# EAGLE design OMNIBUS EstlCam board v3 (EAGLE 9.3.1)
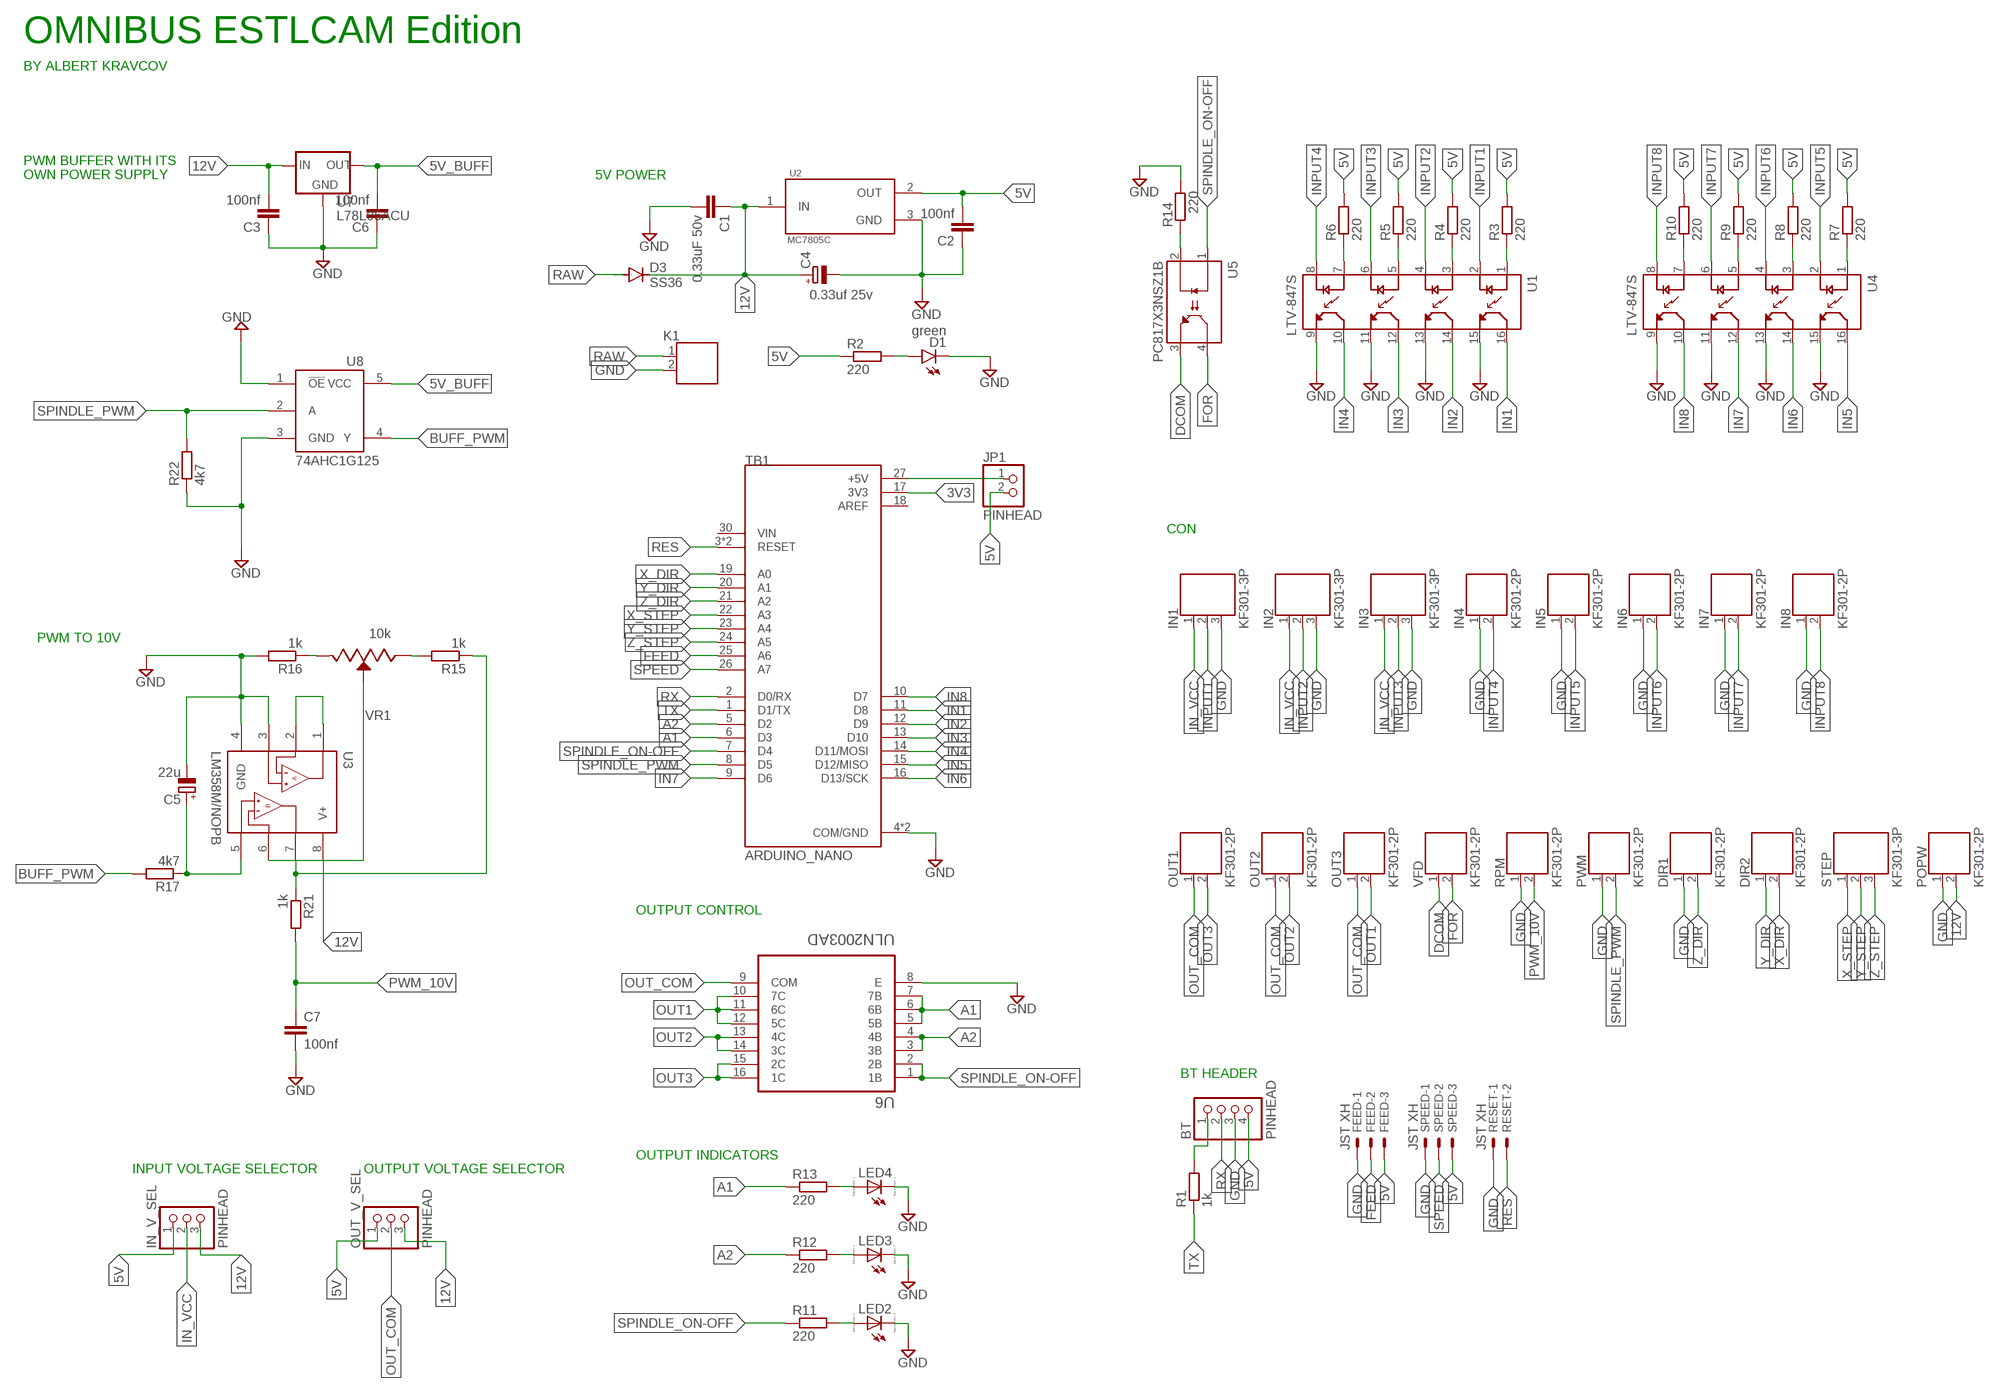
[diagram p0: schematic, sheet 1]

## Parts
BT  PINHEAD  PINHD-1X4  [1X04]
C1  0.33uF 50v  C-EUC1206  [C1206]
C2  100nf  C-EUC0805  [C0805]
C3  100nf  C-EUC0805  [C0805]
C4  0.33uf 25v  CPOL-EUE2-5  [E2-5]
C5  22u  CPOL-EUE2-5  [E2-5]
C6  100nf  C-EUC0805  [C0805]
C7  100nf  C-EUC0805  [C0805]
D1  green  LEDCHIPLED_0805  [CHIPLED_0805]
D3  SS36  ES2D  [SMB]
DIR1  KF301-2P  691131710002  [691131710002]
DIR2  KF301-2P  691131710002  [691131710002]
FEED  JST XH  22-23-2031  [22-23-2031]
IN1  KF301-3P  691131710003  [691131710003]
IN2  KF301-3P  691131710003  [691131710003]
IN3  KF301-3P  691131710003  [691131710003]
IN4  KF301-2P  691131710002  [691131710002]
IN5  KF301-2P  691131710002  [691131710002]
IN6  KF301-2P  691131710002  [691131710002]
IN7  KF301-2P  691131710002  [691131710002]
IN8  KF301-2P  691131710002  [691131710002]
IN_V_SEL  PINHEAD  PINHD-1X3  [1X03]
JP1  PINHEAD  PINHD-1X2  [1X02]
K1  691131710002  [691131710002]
LED2  LED_ESML0603  [LED_SML0603]
LED3  LED_ESML0603  [LED_SML0603]
LED4  LED_ESML0603  [LED_SML0603]
OUT1  KF301-2P  691131710002  [691131710002]
OUT2  KF301-2P  691131710002  [691131710002]
OUT3  KF301-2P  691131710002  [691131710002]
OUT_V_SEL  PINHEAD  PINHD-1X3  [1X03]
POPW  KF301-2P  691131710002  [691131710002]
PWM  KF301-2P  691131710002  [691131710002]
R1  1k  R-EU_R0805  [R0805]
R2  220  R-EU_R0805  [R0805]
R3  220  R-EU_R0805  [R0805]
R4  220  R-EU_R0805  [R0805]
R5  220  R-EU_R0805  [R0805]
R6  220  R-EU_R0805  [R0805]
R7  220  R-EU_R0805  [R0805]
R8  220  R-EU_R0805  [R0805]
R9  220  R-EU_R0805  [R0805]
R10  220  R-EU_R0805  [R0805]
R11  220  R-EU_R0603  [R0603]
R12  220  R-EU_R0603  [R0603]
R13  220  R-EU_R0603  [R0603]
R14  220  R-EU_R0805  [R0805]
R15  1k  R-EU_R0805  [R0805]
R16  1k  R-EU_R0805  [R0805]
R17  4k7  R-EU_R0603  [R0603]
R21  1k  R-EU_R0805  [R0805]
R22  4k7  R-EU_R0805  [R0805]
RESET  JST XH  22-23-2021  [22-23-2021]
RPM  KF301-2P  691131710002  [691131710002]
SPEED  JST XH  22-23-2031  [22-23-2031]
STEP  KF301-3P  691131710003  [691131710003]
TB1  ARDUINO_NANO  [SHIELD_ARDUINO_NANO]
U1  LTV-847S  [SOIC254P1016X460-16N]
U2  MC7805C  L7805ACD2T-TR  [TO254P1515X470-3N]
U3  LM358M/NOPB  [SOIC127P599X175-8N]
U4  LTV-847S  [SOIC254P1016X460-16N]
U5  PC817X3NSZ1B  [DIP762W50P254L495H455Q4]
U6  ULN2003AD  [SOIC127P600X175-16N]
U7  L78L05ACU  [SOT89]
U8  74AHC1G125  [SOT23-5L]
VFD  KF301-2P  691131710002  [691131710002]
VR1  10k  3296W-1-502  [TRIM_3296W-1-502]

## Nets
3V3: TB1.17(3V3)
5V [power]: BT.4 C2.2 FEED.3 IN_V_SEL.1 JP1.2 OUT_V_SEL.1 R2.1 R3.2 R4.2 R5.2 R6.2 R7.2 R8.2 R9.2 R10.2 SPEED.3 U2.2(OUT)
5V_BUFF [power]: C6.2 U7.1(OUT) U8.5(VCC)
12V [power]: C1.1 C3.2 C4.+ D3.C IN_V_SEL.3 OUT_V_SEL.3 POPW.2 U2.1(IN) U3.8(V+) U7.3(IN)
A1 [sign]: R13.1 TB1.6(D3) U6.5(5B) U6.6(6B) U6.7(7B)
A2 [sign]: R12.1 TB1.5(D2) U6.3(3B) U6.4(4B)
ARDU5V [sign]: JP1.1 TB1.27(+5V)
BUFF_PWM [sign]: R17.2 U8.4(Y)
D [sign]: R15.1 R21.1 U3.7(OUTB)
DCOM [power]: U5.3(EMITTER) VFD.1
FEED [sign]: FEED.2 TB1.25(A6)
FOR [power]: U5.4(COLLECTOR) VFD.2
GND: BT.3 C1.2 C2.1 C3.1 C4.- C5.- C6.1 C7.2 D1.C DIR1.1 FEED.1 IN1.3 IN2.3 IN3.3 IN4.1 IN5.1 IN6.1 IN7.1 IN8.1 K1.2 LED2.C LED3.C LED4.C POPW.1 PWM.1 R14.2 R16.2 R22.1 RESET.1 RPM.1 SPEED.1 TB1.4(COM/GND) TB1.29(COM/GND) U1.9(ET3) U1.11(ET2) U1.13(ET1) U1.15(ET) U2.3(GND) U3.3(+INA) U3.4(GND) U4.9(ET3) U4.11(ET2) U4.13(ET1) U4.15(ET) U6.8(E) U7.2(GND) U8.1(!OE) U8.3(GND)
IN1 [sign]: TB1.11(D8) U1.16(CT)
IN2 [sign]: TB1.12(D9) U1.14(CT1)
IN3 [sign]: TB1.13(D10) U1.12(CT2)
IN4 [sign]: TB1.14(D11/MOSI) U1.10(CT3)
IN5 [sign]: TB1.15(D12/MISO) U4.16(CT)
IN6 [sign]: TB1.16(D13/SCK) U4.14(CT1)
IN7 [sign]: TB1.9(D6) U4.12(CT2)
IN8 [sign]: TB1.10(D7) U4.10(CT3)
IN_VCC [power]: IN1.1 IN2.1 IN3.1 IN_V_SEL.2
INPUT1 [sign]: IN1.2 U1.2(C)
INPUT2 [sign]: IN2.2 U1.4(C1)
INPUT3 [sign]: IN3.2 U1.6(C2)
INPUT4 [sign]: IN4.2 U1.8(C3)
INPUT5 [sign]: IN5.2 U4.2(C)
INPUT6 [sign]: IN6.2 U4.4(C1)
INPUT7 [sign]: IN7.2 U4.6(C2)
INPUT8: IN8.2 U4.8(C3)
N$1: D1.A R2.2
N$2 [sign]: R4.1 U1.3(A1)
N$3 [sign]: R5.1 U1.5(A2)
N$4 [sign]: R6.1 U1.7(A3)
N$5 [sign]: R3.1 U1.1(A)
N$6 [sign]: R7.1 U4.1(A)
N$7 [sign]: R8.1 U4.3(A1)
N$8 [sign]: R9.1 U4.5(A2)
N$9 [sign]: R10.1 U4.7(A3)
N$10 [sign]: LED3.A R12.2
N$11 [sign]: LED2.A R11.2
N$12 [sign]: LED4.A R13.2
N$13 [sign]: R14.1 U5.2(CATHODE)
N$14 [sign]: U3.6(-INB) VR1.2(WIPER)
N$15 [sign]: R15.2 VR1.1(CCW)
N$16 [sign]: R16.1 VR1.3(CW)
N$17 [sign]: C5.+ R17.1 U3.5(+INB)
N$18: U3.1(OUTA) U3.2(-INA)
N$19: BT.1 R1.2
OUT1: OUT3.2 U6.10(7C) U6.11(6C) U6.12(5C)
OUT2: OUT2.2 U6.13(4C) U6.14(3C)
OUT3: OUT1.2 U6.15(2C) U6.16(1C)
OUT_COM [power]: OUT1.1 OUT2.1 OUT3.1 OUT_V_SEL.2 U6.9(COM)
PWM_10V [sign]: C7.1 R21.2 RPM.2
RAW [power]: D3.A K1.1
RES [sign]: RESET.2 TB1.3(RESET) TB1.28(RESET)
RX [sign]: BT.2 TB1.2(D0/RX)
SPEED [sign]: SPEED.2 TB1.26(A7)
SPINDLE_ON-OFF [sign]: R11.1 TB1.7(D4) U5.1(ANODE) U6.1(1B) U6.2(2B)
SPINDLE_PWM [sign]: PWM.2 R22.2 TB1.8(D5) U8.2(A)
TX: R1.1 TB1.1(D1/TX)
X_DIR [sign]: DIR2.2 TB1.19(A0)
X_STEP [sign]: STEP.1 TB1.22(A3)
Y_DIR [sign]: DIR2.1 TB1.20(A1)
Y_STEP [sign]: STEP.2 TB1.23(A4)
Z_DIR [sign]: DIR1.2 TB1.21(A2)
Z_STEP [sign]: STEP.3 TB1.24(A5)
Unconnected: TB1.30(VIN)

## Notes on the sheet
- OMNIBUS ESTLCAM Edition
- BY ALBERT KRAVCOV
- PWM BUFFER WITH ITS
  OWN POWER SUPPLY
- 5V POWER
- CON
- PWM TO 10V
- OUTPUT CONTROL
- BT HEADER
- OUTPUT INDICATORS
- INPUT VOLTAGE SELECTOR | OUTPUT VOLTAGE SELECTOR

## Power pins joined to a net without a drawn wire
AREF: TB1.18(AREF)

## Library data of the parts
BT = pinhead:PINHD-1X4: PIN HEADER
C1-C3 C6 C7 = rcl:C-EU: CAPACITOR, European symbol; SPICEPREFIX: C
C4 C5 = rcl:CPOL-EU: POLARIZED CAPACITOR, European symbol; SPICEPREFIX: C
D1 = led:LED: LED OSRAM: - CHIPLED LG R971, LG N971, LY N971, LG Q971, LY Q971, LO R971, LY R971 LH N974, LH R974 LS Q976, LO Q976, LY Q976 LO Q996 - Hyper CHIPLED LW Q18S LB Q993, LB Q99A, LB R99A - SideLED LS A670, LO A670, LY A670, LG A670, LP A670 LB A673, LV A673, LT A673, LW A673 LH A674 LY A675 LS A676, LA A676, LO A676, LY A676, LW A676 LS A679, LY A679, LG A679 - Hyper Micro SIDELED® LS Y876, LA Y876, LO Y876, LY Y876 LT Y87S - SmartLED LW L88C, LW L88S LB L89C, LB L89S, LG L890 LS L89K, LO L89K, LY L89K LS L896, LA L896, LO L896, LY L896 - TOPLED LS T670, LO T670, LY T670, LG T670, LP T670 LSG T670, LSP T670, LSY T670, LOP T670, LYG T670 LG T671, LOG T671, LSG T671 LB T673, LV T673, LT T673, LW T673 LH T674 LS T676, LA T676, LO T676, LY T676, LB T676, LH T676, LSB T676, LW T676 LB T67C, LV T67C, LT T67C, LS T67K, LO T67K, LY T67K, LW E67C LS E67B, LA E67B, LO E67B, LY E67B, LB E67C, LV E67C, LT E67C LW T67C LS T679, LY T679, LG T679 LS T770, LO T770, LY T770, LG T770, LP T770 LB T773, LV T773, LT T773, LW T773 LH T774 LS E675, LA E675, LY E675, LS T675 LS T776, LA T776, LO T776, LY T776, LB T776 LHGB T686 LT T68C, LB T68C - Hyper Mini TOPLED® LB M676 - Mini TOPLED Santana® LG M470 LS M47K, LO M47K, LY M47K Source: http://www.osram.convergy.de LUXEON: - LUMILED® LXK2-PW12-R00, LXK2-PW12-S00, LXK2-PW14-U00, LXK2-PW14-V00 LXK2-PM12-R00, LXK2-PM12-S00, LXK2-PM14-U00 LXK2-PE12-Q00, LXK2-PE12-R00, LXK2-PE12-S00, LXK2-PE14-T00, LXK2-PE14-U00 LXK2-PB12-K00, LXK2-PB12-L00, LXK2-PB12-M00, LXK2-PB14-N00, LXK2-PB14-P00, LXK2-PB14-Q00 LXK2-PR12-L00, LXK2-PR12-M00, LXK2-PR14-Q00, LXK2-PR14-R00 LXK2-PD12-Q00, LXK2-PD12-R00, LXK2-PD12-S00 LXK2-PH12-R00, LXK2-PH12-S00 LXK2-PL12-P00, LXK2-PL12-Q00, LXK2-PL12-R00 Source: www.luxeon.com KINGBRIGHT: KA-3528ASYC Source: www.kingbright.com
D3 = diode:ES2D: DIODE super fast rectifier, 2 A
DIR1 DIR2 IN4-IN8 K1 OUT1-OUT3 POPW PWM RPM VFD = Wurth_Terminal_Blocks_Connectors_rev15d:691131710002: WR-TBL Terminal block - CUU5/2 CUU5/2GR - 2 Pins;=>Code : Con_TBL_Screw_PClamp_5.00_6911317100xx_691131710002 <http://katalog.we-online.de/media/images/eican/Con_TBL_Screw_PClamp_5.00_6911317100xx_pf2.jpg> Details see: http://katalog.we-online.de/em/datasheet/6911317100xx.pdf Created 11/23/2014, Karrer Zheng 2014 (C) Wurth Elektronik
FEED SPEED = con-molex:22-23-2031: .100" (2.54mm) Center Header - 3 Pin; MF: MOLEX; MPN: 22-23-2031; OC_FARNELL: 1462950; OC_NEWARK: 30C0862
IN1-IN3 STEP = Wurth_Terminal_Blocks_Connectors_rev15d:691131710003: WR-TBL Terminal block - CUU5/3 - 3 Pins;=>Code : Con_TBL_Screw_PClamp_5.00_6911317100xx_691131710003 <http://katalog.we-online.de/media/images/eican/Con_TBL_Screw_PClamp_5.00_6911317100xx_pf2.jpg> Details see: http://katalog.we-online.de/em/datasheet/6911317100xx.pdf Created 11/3/2014, Karrer Zheng 2014 (C) Wurth Elektronik
IN_V_SEL OUT_V_SEL = pinhead:PINHD-1X3: PIN HEADER
JP1 = pinhead:PINHD-1X2: PIN HEADER
LED2-LED4 = eagle-ltspice:LED_E: LED Source: http://www.osram.convergy.de Source: www.luxeon.com Source: www.kingbright.com; SPICEMODEL: NONE; SPICEPREFIX: D; SPICETYPE: diode
R1-R17 R21 R22 = rcl:R-EU_: RESISTOR, European symbol; SPICEPREFIX: R
RESET = con-molex:22-23-2021: .100" (2.54mm) Center Header - 2 Pin; MF: MOLEX; MPN: 22-23-2021; OC_FARNELL: 1462926; OC_NEWARK: 25C3832
TB1 = ARDUINO_NANO-2:ARDUINO_NANO: Arduino Nano, Through Hole; AVAILABILITY: Unavailable; DESCRIPTION: ATmega4809 Arduino Nano Every with Headers AVR® AVR MCU 8-Bit Embedded Evaluation Board; MF: Arduino; MP: ARDUINO NANO; PACKAGE: None; PRICE: None
U1 U4 = LTV-847S:LTV-847S: Optocoupler DC-IN 4-CH Transistor DC-OUT 16-Pin PDIP SMD Check prices <https://pricing.snapeda.com/parts/LTV-847S/Lite-On%20Inc./view-part?ref=eda>; AVAILABILITY: Bad; DESCRIPTION: Optoisolator Transistor Output 5000Vrms 4 Channel 16-SMD; MF: Lite-On Inc.; MP: LTV-847S; PACKAGE: SMD-16 Lite-On; PRICE: None; PURCHASE-URL: https://pricing.snapeda.com/search/part/LTV-847S/?ref=eda
U2 = L7805ACD2T-TR:L7805ACD2T-TR: Positive voltage regulator ICs Check prices <https://pricing.snapeda.com/parts/L7805ACD2T-TR/STMicroelectronics/view-part?ref=eda>; AVAILABILITY: Good; DESCRIPTION: Linear Voltage Regulator IC Positive Fixed 1 Output 1.5A D2PAK; MF: STMicroelectronics; MP: L7805ACD2T-TR; PACKAGE: D2PAK STMicroelectronics; PRICE: None; PURCHASE-URL: https://pricing.snapeda.com/search/part/L7805ACD2T-TR/?ref=eda
U3 = LM358M_NOPB:LM358M/NOPB: Check prices <https://snapeda.com/parts/LM358M/NOPB/NOPB/Texas%20Instruments/view-part/?ref=eda> Check prices <https://pricing.snapeda.com/parts/LM358M/Texas%20Instruments/view-part?ref=eda>; AVAILABILITY: Warning; DESCRIPTION: 2-Channel, 1MHz, industry standard, 32V op amp 8-SOIC 0 to 70; MF: Texas Instruments; MP: LM358M; PACKAGE: SOIC-8 Texas Instruments; PRICE: None; PURCHASE-URL: https://pricing.snapeda.com/search/part/LM358M/?ref=eda
U5 = PC817X3NSZ1B:PC817X3NSZ1B: Optoisolator Transistor Output 1 Channel 4-DIP Check prices <https://pricing.snapeda.com/parts/PC817X3NSZ1B/Sharp%20Microelectronics/view-part?ref=eda>; AVAILABILITY: Bad; DESCRIPTION: Optoisolator Transistor Output 1 Channel 4-DIP; MF: Sharp Microelectronics; MP: PC817X3NSZ1B; PACKAGE: None; PRICE: None; PURCHASE-URL: https://pricing.snapeda.com/search/part/PC817X3NSZ1B/?ref=eda
U6 = ULN2003AD:ULN2003AD: Check prices <https://pricing.snapeda.com/parts/ULN2003AD/Texas%20Instruments/view-part?ref=eda>; AVAILABILITY: Warning; DESCRIPTION: 50-V, 7-ch darlington transistor array, -20C to 70C 16-SOIC -40 to 70; MF: Texas Instruments; MP: ULN2003AD; PACKAGE: SOIC-16 Texas Instruments; PRICE: None; PURCHASE-URL: https://pricing.snapeda.com/search/part/ULN2003AD/?ref=eda
U7 = L78L05ACU:L78L05ACU: 5V Positive voltage regulator SMD SOT89 Package; AVAILABILITY: Unavailable; DESCRIPTION: Linear Voltage Regulator IC Positive Fixed 1 Output 100mA SOT-89-3; MF: STMicroelectronics; MP: L78L05ACU; PACKAGE: SOT-89-3 STMicroelectronics; PRICE: None
U8 = 74AHC1G125:74AHC1G125; AVAILABILITY: Unavailable; DESCRIPTION: Buffer, Non-Inverting 1 Element 1 Bit per Element 3-State Output SOT-23-5; MF: Texas Instruments; MP: 74AHC1G125; PACKAGE: SOT-23 Texas Instruments; PRICE: None
VR1 = 3296W-1-502:3296W-1-502: Res Cermet Trimmer 500K Ohm 10% 0.5W 25(Elec)Turn 2.19mm (9.53 X 4.83 X 11.55mm) Pin Thru-Hole Tube Check prices <https://pricing.snapeda.com/parts/3296W-1-502/Bourns/view-part?ref=eda>; AVAILABILITY: Warning; DESCRIPTION: 5 kOhms 0.5W, 1/2W PC Pins Through Hole Trimmer Potentiometer Cermet 25 Turn Top Adjustment; MF: Bourns; MP: 3296W-1-502; PACKAGE: SOT-23-5 Bourns; PRICE: None; PURCHASE-URL: https://pricing.snapeda.com/search/part/3296W-1-502/?ref=eda

## Net classes
0 default: width 0.305 mm, drill 0.305 mm, clearance 0.305 mm
1 power: width 0.635 mm, drill 0.635 mm, clearance 0.635 mm
2 sign: width 0.508 mm, drill 0.508 mm, clearance 0.508 mm

## Board
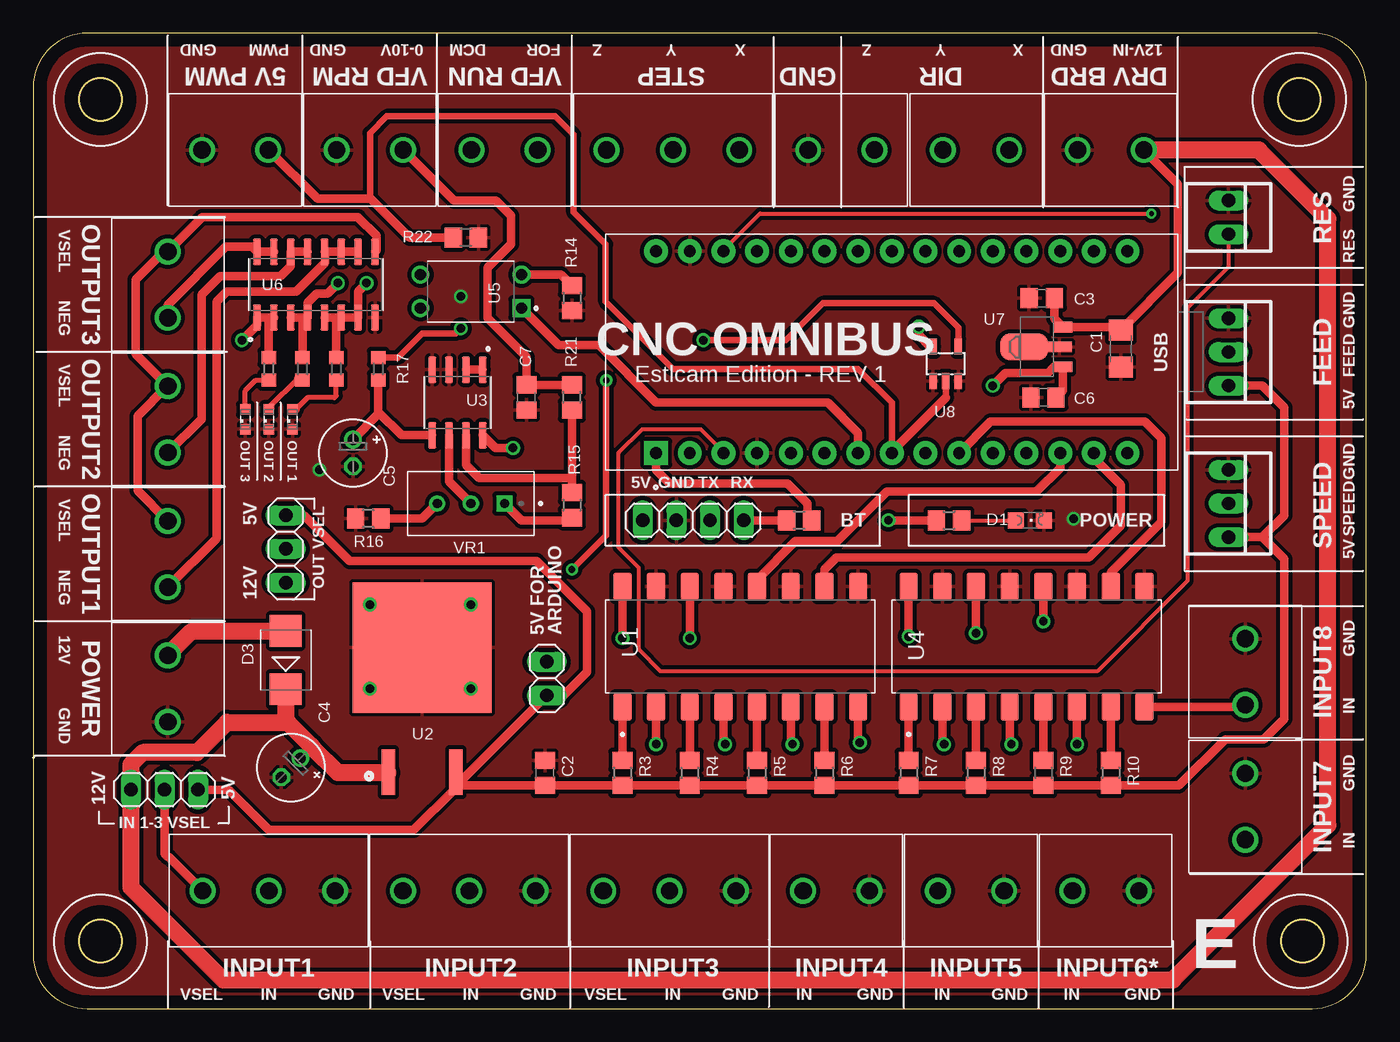
[diagram p1: board, top side]
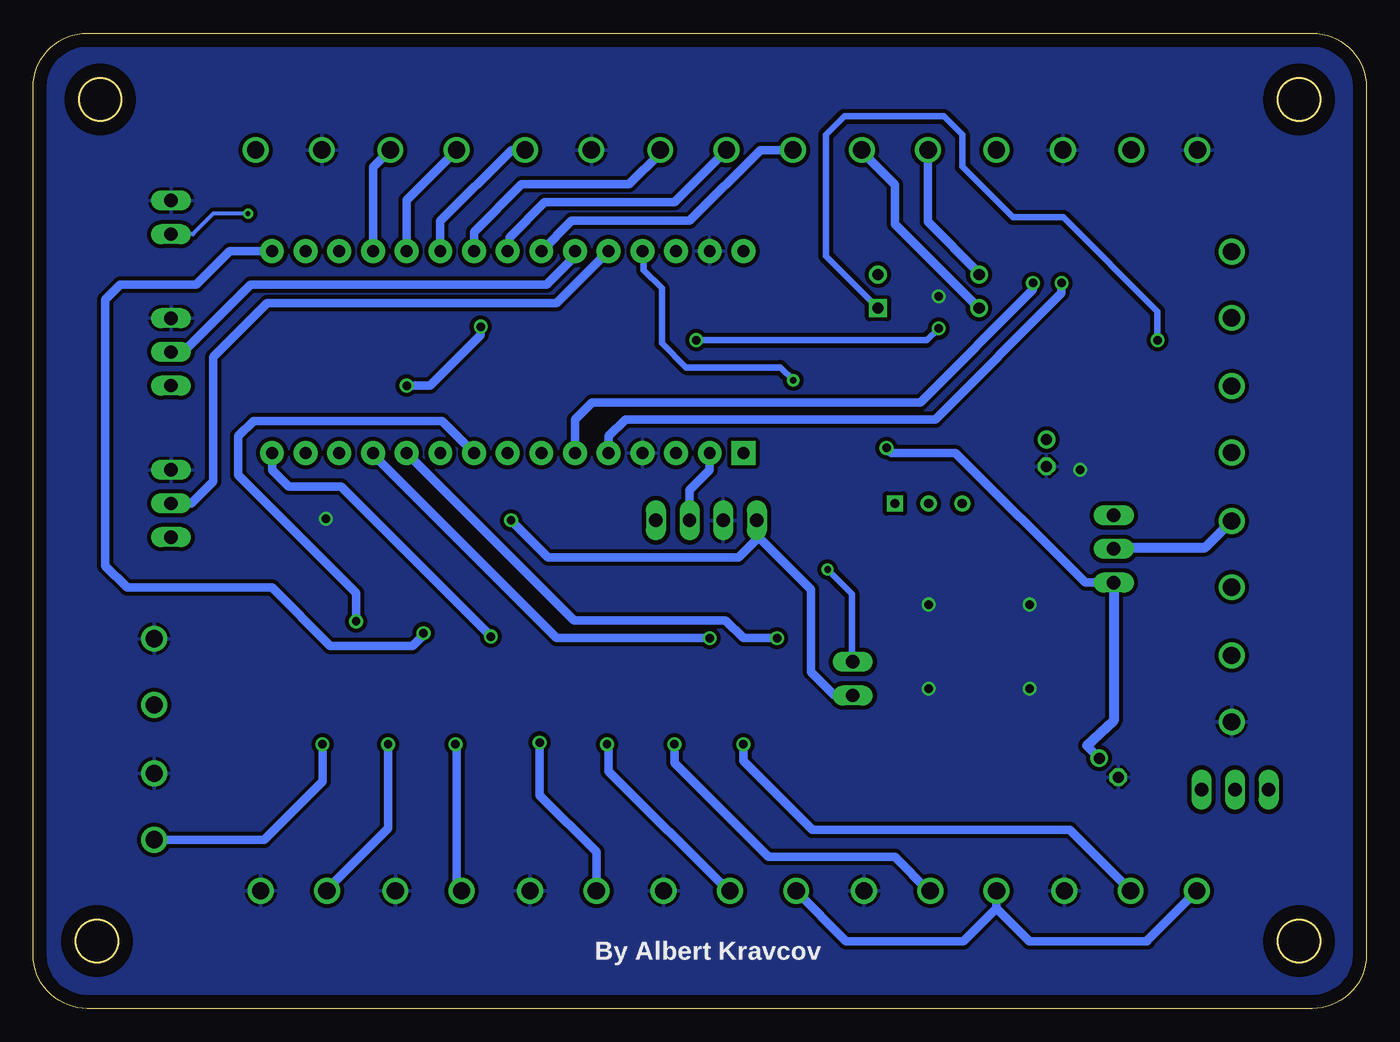
[diagram p2: board, bottom side, seen from below]

Size 100.56 x 73.58 mm. Coordinates in mm from the lower left corner, seen from the top.
Outline: 0,69.52 0,4.06 arc90 4.06,0 96.5,0 arc90 100.56,4.06 100.56,69.52 arc90 96.5,73.58 4.06,73.58 arc90 0,69.52
Outline: circle at 5.08,5.08 radius 1.6
Outline: circle at 95.76,5.08 radius 1.6
Outline: circle at 5.08,68.58 radius 1.6
Outline: circle at 95.5,68.58 radius 1.6
Copper layers (1*16): Top 0.035mm / dielectric 1.5mm / Bottom 0.035mm
Design rules "default *": minimum track width 6mil, minimum drill 0.35mm, track to track 6mil, track to pad 6mil, pad to pad 6mil, via to via 6mil, smd to smd 6mil, copper to edge 40mil, drill to drill 6mil, minimum pad ring 10mil, minimum via ring 8mil, stop-mask expansion 4mil, vias tented up to drill 2mm, thermal gap 10mil

### Footprints (pad centres in the part's own frame; a part is rotated, then mirrored left to right if it is on the bottom)
1X04 = drill 1.016 long: 1 -3.81,0; 2 -1.27,0; 3 1.27,0; 4 3.81,0
C1206 = smd 1.6 x 1.8: 1 -1.4,0; 2 1.4,0
C0805 = smd 1.3 x 1.5: 1 -0.95,0; 2 0.95,0
E2-5 = drill 0.813 pad 1.27: + -1.016,0 | drill 0.813 pad 1.27 octagon: - 1.016,0
CHIPLED_0805 = smd 1.2 x 1.2: A 0,-1.05; C 0,1.05
SMB = smd 2.4 x 2.4: A 2.2,0; C -2.2,0
691131710002 = drill 1.3: 1 -2.5,0; 2 2.5,0
22-23-2031 = drill 1 long: 1 -2.54,0; 2 0,0; 3 2.54,0
691131710003 = drill 1.3: 1 -5,0; 2 0,0; 3 5,0
1X03 = drill 1.016 long: 1 -2.54,0; 2 0,0; 3 2.54,0
1X02 = drill 1.016 long: 1 -1.27,0; 2 1.27,0
LED_SML0603 = smd 0.8 x 0.8: A 0.75,0; C -0.75,0
R0805 = smd 1.3 x 1.5: 1 -0.95,0; 2 0.95,0
R0603 = smd 1 x 1.1: 1 -0.85,0; 2 0.85,0
22-23-2021 = drill 1 long: 1 -1.27,0; 2 1.27,0
SHIELD_ARDUINO_NANO = drill 0.9 pad 1.8 square: 1 -7.62,17.78 | drill 0.9 pad 1.8: 2 -7.62,15.24; 3 -7.62,12.7; 4 -7.62,10.16; 5 -7.62,7.62; 6 -7.62,5.08; 7 -7.62,2.54; 8 -7.62,0; 9 -7.62,-2.54; 10 -7.62,-5.08; 11 -7.62,-7.62; 12 -7.62,-10.16; 13 -7.62,-12.7; 14 -7.62,-15.24; 15 -7.62,-17.78; 16 7.62,-17.78; 17 7.62,-15.24; 18 7.62,-12.7; 19 7.62,-10.16; 20 7.62,-7.62; 21 7.62,-5.08; 22 7.62,-2.54; 23 7.62,0; 24 7.62,2.54; 25 7.62,5.08; 26 7.62,7.62; 27 7.62,10.16; 28 7.62,12.7; 29 7.62,15.24; 30 7.62,17.78
SOIC254P1016X460-16N = smd 2.09 x 1.39: 1 -4.54,8.89; 2 -4.54,6.35; 3 -4.54,3.81; 4 -4.54,1.27; 5 -4.54,-1.27; 6 -4.54,-3.81; 7 -4.54,-6.35; 8 -4.54,-8.89; 9 4.54,-8.89; 10 4.54,-6.35; 11 4.54,-3.81; 12 4.54,-1.27; 13 4.54,1.27; 14 4.54,3.81; 15 4.54,6.35; 16 4.54,8.89
TO254P1515X470-3N = smd 3.45 x 1: 1 -6.3,2.54; 2 -6.3,-2.54 | smd 9.85 x 10.5: 3 3.1,0
SOIC127P599X175-8N = smd 1.97 x 0.6: 1 -2.47,1.905; 2 -2.47,0.635; 3 -2.47,-0.635; 4 -2.47,-1.905; 5 2.47,-1.905; 6 2.47,-0.635; 7 2.47,0.635; 8 2.47,1.905
DIP762W50P254L495H455Q4 = drill 0.84 pad 1.26 square: 1 -3.81,1.27 | drill 0.84 pad 1.26: 2 -3.81,-1.27; 3 3.81,-1.27; 4 3.81,1.27
SOIC127P600X175-16N = smd 1.97 x 0.6: 1 -2.475,4.445; 2 -2.475,3.175; 3 -2.475,1.905; 4 -2.475,0.635; 5 -2.475,-0.635; 6 -2.475,-1.905; 7 -2.475,-3.175; 8 -2.475,-4.445; 9 2.475,-4.445; 10 2.475,-3.175; 11 2.475,-1.905; 12 2.475,-0.635; 13 2.475,0.635; 14 2.475,1.905; 15 2.475,3.175; 16 2.475,4.445
SOT89 = smd 0.8 x 1.4: 1 -1.499,-1.981; 3 1.499,-1.981 | smd 0.8 x 1.9: 2 0,-1.727 | smd 2.032 x 3.65: 2@1 0,0.94
SOT23-5L = smd 0.55 x 1.2: 1 -0.95,-1.3; 2 0,-1.3; 3 0.95,-1.3; 4 0.95,1.3; 5 -0.95,1.3
TRIM_3296W-1-502 = drill 0.71 square: 1 -2.54,0 | drill 0.71: 2 0,0; 3 2.54,0

### Placement (x,y rotation side)
BT  49.78,36.83 180 top
C1  82.04,49.78 270 top
C2  38.61,17.78 270 top
C3  76.07,53.59 0 top
C4  19.43,18.16 225 top
C5  24.13,41.91 270 top
C6  76.2,46.1 0 top
C7  37.21,46.1 270 top
D1  75.18,36.83 270 top
D3  19.05,26.29 90 top
DIR1  60.96,64.77 0 top
DIR2  71.12,64.77 0 top
FEED  90.17,49.53 270 top
IN1  17.78,8.89 0 top
IN2  32.89,8.89 0 top
IN3  48.01,8.89 0 top
IN4  60.58,8.89 180 top
IN5  70.74,8.89 180 top
IN6  80.9,8.89 180 top
IN7  91.44,15.24 270 top
IN8  91.44,25.4 270 top
IN_V_SEL  9.91,16.51 180 top
JP1  38.73,24.89 270 top
K1  10.16,24.13 270 top
LED2  16,44.45 90 top
LED3  17.78,44.45 90 top
LED4  19.56,44.45 90 top
OUT1  10.16,54.61 270 top
OUT2  10.16,44.45 270 top
OUT3  10.16,34.29 270 top
OUT_V_SEL  19.05,34.67 270 top
POPW  81.28,64.77 0 top
PWM  15.24,64.77 0 top
R1  57.78,36.83 180 top
R2  69.09,36.83 0 top
R3  44.45,17.78 270 top
R4  49.53,17.78 270 top
R5  54.61,17.78 270 top
R6  59.69,17.78 270 top
R7  66.04,17.78 270 top
R8  71.12,17.78 270 top
R9  76.2,17.78 270 top
R10  81.28,17.78 270 top
R11  17.78,48.26 270 top
R12  20.32,48.26 270 top
R13  22.86,48.26 270 top
R14  40.64,53.59 270 top
R15  40.64,37.97 270 top
R16  25.27,36.96 180 top
R17  26.04,48.26 90 top
R21  40.64,46.1 90 top
R22  32.64,58.17 180 top
RESET  90.17,59.69 270 top
RPM  25.4,64.77 0 top
SPEED  90.17,38.1 270 top
STEP  48.26,64.77 180 top
TB1  64.77,49.53 90 top
U1  53.34,27.3 90 top
U2  29.34,24.13 90 top
U3  32,45.72 270 top
U4  74.93,27.3 90 top
U5  33.02,54.1 180 top
U6  21.34,54.61 90 top
U7  75.69,49.91 90 top
U8  68.83,48.64 0 top
VFD  35.56,64.77 0 top
VR1  33.02,38.1 180 top

### Tracks (layer width: path | path; a pad name or v marks a point on that pad's centre or on a via)
5V  (via drill 0.64)
  Top 0.635: U2.2 31.75,17.7 31.75,16.51 28.7,13.46 17.78,13.46 14.73,16.51 IN_V_SEL.1 | U2.2 31.88,16.83 C2.2 R3.2 R4.2 R5.2 R6.2 R7.2 R8.2 R9.2 R10.2 86.43,16.83 89.92,20.32 92.84,20.32 94.36,21.84 94.36,33.91 92.71,35.56 | U2.2 32.41,17.3 JP1.2 40.01,23.62 41.78,25.4 41.78,29.97 37.97,33.78 23.88,33.78 20.45,37.21 OUT_V_SEL.1 | R2.1 v64.52,36.83 | SPEED.3 92.71,35.56 | 92.71,35.56 94.36,37.21 94.36,45.34 92.71,46.99 FEED.3
  Bottom 0.635: JP1.2 40.13,23.62 41.91,25.4 41.91,31.62 45.97,35.69 BT.4 45.97,35.43 47.37,34.04 61.72,34.04 v64.52,36.83
5V_BUFF  (via drill 0.64)
  Top 0.635: C6.2 77.67,46.62 U7.1 77,48.41 76.53,47.94 73.34,47.94 v72.39,46.99 | v66.8,51.44 66.8,50.8 67.66,49.94 U8.5
  Bottom 0.635: v72.39,46.99 70.61,46.99 66.8,50.8 v66.8,51.44
12V  (via drill 0.64)
  Top 0.635: U2.1 26.75,17.78 | POPW.2 86.36,62.19 86.36,55.5 C1.1 81.82,51.41 U7.3 77.02,52.06 C3.2 | U3.8 34.87,42.29 v36.2,42.29 | 20.98,19.82 C4.+ 21.09,19.68 | 19.21,21.59 18.96,21.59 19.05,21.68
  Top 1.27: 26.75,17.78 22.99,17.78 21.09,19.68 | POPW.2 92.46,64.77 97.66,59.56 97.66,13.84 85.98,2.16 14.35,2.16 7.37,9.14 IN_V_SEL.3 7.37,18.41 8.27,19.32 12.36,19.32 14.62,21.59 18.96,21.59 | 20.98,19.82 19.21,21.59 | D3.C 19.05,21.68
  Bottom 0.635: C4.+ 21.08,19.82 | OUT_V_SEL.3 21.21,32.13 30.99,41.91 35.81,41.91 v36.2,42.29
  Bottom 0.762: OUT_V_SEL.3 19.05,21.71 21.08,19.82
A1  (via drill 0.64)
  Top 0.635: U6.5 U6.7 | U6.7 U6.6 22.86,51.75 R13.1 | U6.7 24.51,54.1 v25.15,54.74
  Bottom 0.635: v25.15,54.74 25.15,54.23 33.66,45.72 58.42,45.72 59.69,44.45 TB1.6
A2  (via drill 0.64)
  Top 0.635: U6.4 20.32,51.75 R12.1 | U6.4 U6.3 | v22.99,54.74 22.2,53.95 21.37,53.95 20.7,53.27 U6.4
  Bottom 0.635: v22.99,54.74 22.99,53.98 32.51,44.45 55.88,44.45 57.15,43.18 TB1.5
ARDU5V  (via drill 0.51)
  Top 0.508: v40.64,33.12 40.66,33.12 43.23,35.69 v43.23,47.4
  Bottom 0.508: v40.64,33.12 38.81,31.29 38.81,26.26 JP1.1 | v43.23,47.4 44.2,48.36 51.31,48.36 53.14,50.19 53.14,54.33 54.51,55.7 54.51,57.05 TB1.27
BUFF_PWM  (via drill 0.64)
  Top 0.508: U8.4 69.78,51.37 67.95,53.21 59.56,53.21 56.77,50.42 v50.55,50.42 | R17.2 27.52,49.11 29.34,50.93 31.88,50.93 v32.26,51.31
  Bottom 0.508: v32.26,51.31 33.15,50.42 v50.55,50.42
D
  Top 0.635: R21.1 40.64,40.01 | 40.64,40.01 R15.1 | U3.7 32.64,41.02 33.66,40.01 40.64,40.01
DCOM
  Bottom 0.635: VFD.1 33.06,59.35 29.21,55.5 U5.3
FEED
  Bottom 0.635: FEED.2 89.25,49.53 84.17,54.61 61.85,54.61 59.69,56.77 TB1.25
FOR
  Bottom 0.635: U5.4 35.56,59.18 35.56,62.14 38.06,64.64 VFD.2
GND  (via drill 0.64)
  other vias: 25.4,30.48 33.02,30.48 33.02,24.13 25.4,24.13 32.26,53.72 78.49,36.96 21.59,40.64
  pour Top: -1.27,73.66 -1.27,-0.86 arc45 -0.08,-3.73 0,-3.81 107.95,-3.81 107.95,54.11 arc45 100.41,72.31 99.06,73.66
  pour Bottom: -3.81,77.47 -3.81,-5.08 101.19,-5.08 arc-45 104.06,-6.27 104.14,-6.35 104.14,71.98 arc45 102.95,74.85 100.33,77.47
IN1  (via drill 0.64)
  Top 0.635: U1.16 v44.45,27.94
  Bottom 0.635: TB1.11 59.77,29.29 48.34,29.29 46.99,27.94 v44.45,27.94
IN2  (via drill 0.64)
  Top 0.635: U1.14 v49.53,27.94
  Bottom 0.635: TB1.12 74.93,41.78 61.09,27.94 v49.53,27.94
IN3
  Top 0.635: U1.12 54.61,32.35 57.52,35.25 60.65,35.25 64.39,38.99 75.69,38.99 77.47,40.77 TB1.13
IN4
  Top 0.635: U1.10 59.69,33.12 60.61,34.04 79.63,34.04 82.04,36.45 82.04,39.5 80.01,41.53 TB1.14
IN5  (via drill 0.64)
  Top 0.635: U4.16 v66.04,28.07
  Bottom 0.635: v66.04,28.07 77.34,39.37 81.28,39.37 82.55,40.64 TB1.15
IN6  (via drill 0.64)
  Top 0.635: U4.14 v71.12,28.32
  Bottom 0.635: TB1.16 85.73,57.15 88.27,54.61 93.98,54.61 95.12,53.47 95.12,33.4 93.47,31.75 82.55,31.75 78.16,27.36 71.96,27.36 71.12,28.19 v71.12,28.32
IN7  (via drill 0.64)
  Top 0.635: U4.12 v76.2,29.21
  Bottom 0.635: TB1.9 69.72,44.32 83.95,44.32 85.09,43.18 85.09,40.26 76.2,31.37 v76.2,29.21
IN8
  Top 0.635: TB1.10 72.21,44.27 83.87,44.27 85.09,43.05 85.09,36.7 81.28,32.89 U4.10
IN_VCC
  Top 0.635: IN1.1 10.24,11.43 10.16,11.43 9.91,11.68 IN_V_SEL.2
  Bottom 0.635: IN1.1 16.51,5.16 16.51,5.08 25.4,5.08 27.89,7.57 | IN2.1 27.89,7.57 | 27.89,7.57 30.39,5.08 39.24,5.08 43.03,8.87 IN3.1
INPUT1  (via drill 0.64)
  Top 0.635: U1.2 v46.99,19.94
  Bottom 0.635: v46.99,19.94 46.99,18.67 41.78,13.46 22.35,13.46 IN1.2
INPUT2  (via drill 0.64)
  Top 0.635: U1.4 52.07,20.07 v52.2,19.94
  Bottom 0.635: v52.2,19.94 52.2,18.54 45.09,11.43 35.56,11.43 33.02,8.89 IN2.2
INPUT3  (via drill 0.64)
  Top 0.635: U1.6 57.15,20.07 v57.28,19.94
  Bottom 0.635: v57.28,19.94 57.15,19.81 57.15,17.91 48.13,8.89 IN3.2
INPUT4  (via drill 0.64)
  Top 0.635: U1.8 62.23,20.19 v62.36,20.07
  Bottom 0.635: v62.36,20.07 62.36,16.09 58.08,11.81 IN4.2
INPUT5  (via drill 0.64)
  Top 0.635: U4.2 68.58,20.07 v68.71,19.94
  Bottom 0.635: v68.71,19.94 68.62,19.85 68.62,9.27 IN5.2
INPUT6  (via drill 0.64)
  Top 0.635: U4.4 73.66,20.07 v73.79,19.94
  Bottom 0.635: v73.79,19.94 73.79,13.59 78.4,8.98 IN6.2
INPUT7  (via drill 0.64)
  Top 0.635: U4.6 v78.74,19.94
  Bottom 0.635: v78.74,19.94 78.74,17.14 83.15,12.74 IN7.2
INPUT8
  Top 0.635: IN8.2 91.31,22.77 U4.8
N$1
  Top 0.305: R2.2 D1.A
N$2
  Top 0.635: U1.3 R4.1
N$3
  Top 0.635: U1.5 R5.1
N$4
  Top 0.635: U1.7 R6.1
N$5
  Top 0.635: U1.1 R3.1
N$6
  Top 0.635: U4.1 R7.1
N$7
  Top 0.635: U4.3 R8.1
N$8
  Top 0.635: U4.5 R9.1
N$9
  Top 0.635: U4.7 R10.1
N$10
  Top 0.381: 19.99,47.54 17.78,45.33 LED3.A
  Top 0.635: R12.2 20.19,47.54 19.99,47.54
N$11
  Top 0.381: LED2.A 16,46.61 16.8,47.41 R11.2
N$12
  Top 0.381: 19.81,45.2 20.7,46.09 22.72,46.09 22.86,46.23 R13.2
  Top 0.635: LED4.A 19.81,45.2
N$13
  Top 0.635: U5.2 39.81,55.37 R14.1
N$14
  Top 0.635: VR1.2 31.37,39.75 U3.6
N$15
  Top 0.635: VR1.1 36.83,36.83 40.45,36.83 R15.2
N$16
  Top 0.635: R16.1 29.34,36.96 VR1.3
N$17
  Top 0.635: U3.5 27.78,43.25 26.04,45 R17.1 26.04,44.83 C5.+
N$18
  Top 0.635: U3.1 U3.2
N$19
  Top 0.635: R1.2 BT.1
OUT1
  Top 0.305: U6.10 24.49,57.09
  Top 0.635: 24.49,57.09 U6.11 U6.12 22.02,57.03 22.02,56.29 19.84,54.1 14.61,54.1 13.84,53.34 13.84,35.47 OUT3.2
OUT2
  Top 0.635: OUT2.2 12.66,44.45 12.7,44.45 12.7,53.85 14.1,55.25 18.67,55.25 19.43,56.01 U6.14 U6.13
OUT3
  Top 0.635: OUT1.2 10.16,53.09 14.54,57.47 16.51,57.47 U6.16 U6.15
OUT_COM
  Top 0.635: U6.9 25.89,57.2 25.89,58.29 24.51,59.67 24.51,59.69 12.74,59.69 OUT1.1 9.87,57.11 7.75,54.99 7.75,49.36 OUT2.1 10.12,46.95 7.87,44.7 7.87,39.08 OUT3.1
  Bottom 0.635: OUT_V_SEL.2 18.92,34.8
  Bottom 0.762: OUT3.1 12.15,34.8 18.92,34.8
PWM_10V
  Top 0.635: RPM.2 27.94,64.77 31.75,60.96 34.92,60.96 36.07,59.82 36.07,57.66 34.29,55.88 34.29,52.07 37.21,49.15 C7.1 R21.2
RAW
  Top 0.635: D3.A 19.01,28.45
  Top 0.762: K1.1 10.16,26.67
  Top 1.27: 10.16,26.67 11.94,28.45 19.01,28.45
RES  (via drill 0.35)
  Top 0.305: v84.35,59.97 54.84,59.97 52.07,57.2 TB1.28 | TB1.3 52.07,41.99 50.34,43.71 45.95,43.71 44.17,41.94 44.17,34.77 45.7,33.25 45.7,27.08 47.32,25.45 80.26,25.45 87.07,32.26 87.07,52.83 90.17,55.93 RESET.2
  Bottom 0.305: RESET.2 88.52,58.42 86.97,59.97 v84.35,59.97
RX
  Bottom 0.635: TB1.2 49.53,40.64 51.05,39.12 BT.2
SPEED
  Bottom 0.635: TB1.26 61.09,53.21 82.93,53.21 87,49.15 87,39.75 88.65,38.1 SPEED.2
SPINDLE_ON-OFF  (via drill 0.64)
  Top 0.635: R11.1 17.78,51.75 U6.2 U6.1 16.89,51.56 v15.75,50.42 | U5.1 39.62,50.04 42.67,50.04 46.99,45.72 59.94,45.72 62.23,43.43 TB1.7
  Bottom 0.508: U5.1 40.77,56.77 40.77,65.91 39.37,67.31 31.88,67.31 30.48,65.91 30.48,63.5 26.67,59.69 22.86,59.69 15.75,52.58 v15.75,50.42
SPINDLE_PWM
  Top 0.508: U8.2 68.83,46.1 | TB1.8 64.77,45.72 62.23,48.26 48.26,48.26 43.18,53.34 43.18,57.66 40.77,60.07 40.77,65.91 39.37,67.31 26.67,67.31 25.4,66.04 25.4,61.09
  Top 0.635: PWM.2 17.78,64.77 21.46,61.09 25.4,61.09 25.47,61.09 28.39,58.17 R22.2 | 68.83,46.1 64.77,42.04 TB1.8
TX
  Top 0.635: R1.1 58.42,37.15 58.42,38.1 56.9,39.62 48.01,39.62 46.99,40.64 TB1.1
X_DIR
  Bottom 0.635: DIR2.2 74.93,63.46 TB1.19
X_STEP
  Bottom 0.635: STEP.1 53.26,64.52 55.6,62.18 63.71,62.18 67.31,58.57 TB1.22
Y_DIR
  Bottom 0.635: DIR2.1 72.39,61 TB1.20
Y_STEP
  Bottom 0.635: TB1.23 64.64,57.28 64.64,58.17 61.98,60.83 52.2,60.83 STEP.2
Z_DIR
  Bottom 0.635: DIR1.2 64.48,64.77 69.85,59.4 TB1.21
Z_STEP
  Bottom 0.635: TB1.24 59.94,59.44 51.05,59.44 45.71,64.77 STEP.3

### Text on the board
tNames: GND | PWM | GND | 0-10V | DCM | FOR | Z | Y | X | Z | Y | X | GND | 12V-IN | 5V PWM | VFD RPM | VFD RUN | STEP | GND | DIR | DRV BRD | GND | RES | VSEL | RES | OUTPUT3 | NEG | GND | CNC OMNIBUS | USB | FEED | FEED | VSEL | Estlcam Edition - REV 1 | 5V | OUTPUT2 | NEG | OUT 3 | OUT 2 | OUT 1 | GND | 5V | GND | TX | RX | SPEED | VSEL | 5V | SPEED | BT | POWER | OUT VSEL | OUTPUT1 | 5V | 12V | NEG | 5V FOR / ARDUINO | GND | 12V | INPUT8 | POWER | IN | GND | GND | 12V | 5V | INPUT7 | IN 1-3 VSEL | IN | E | INPUT1 | INPUT2 | INPUT3 | INPUT4 | INPUT5 | INPUT6* | VSEL | IN | GND | VSEL | IN | GND | VSEL | IN | GND | IN | GND | IN | GND | IN | GND
bNames: By Albert Kravcov